# EasyEDA Pro project 通信+控制电路板.epro, board PCB1
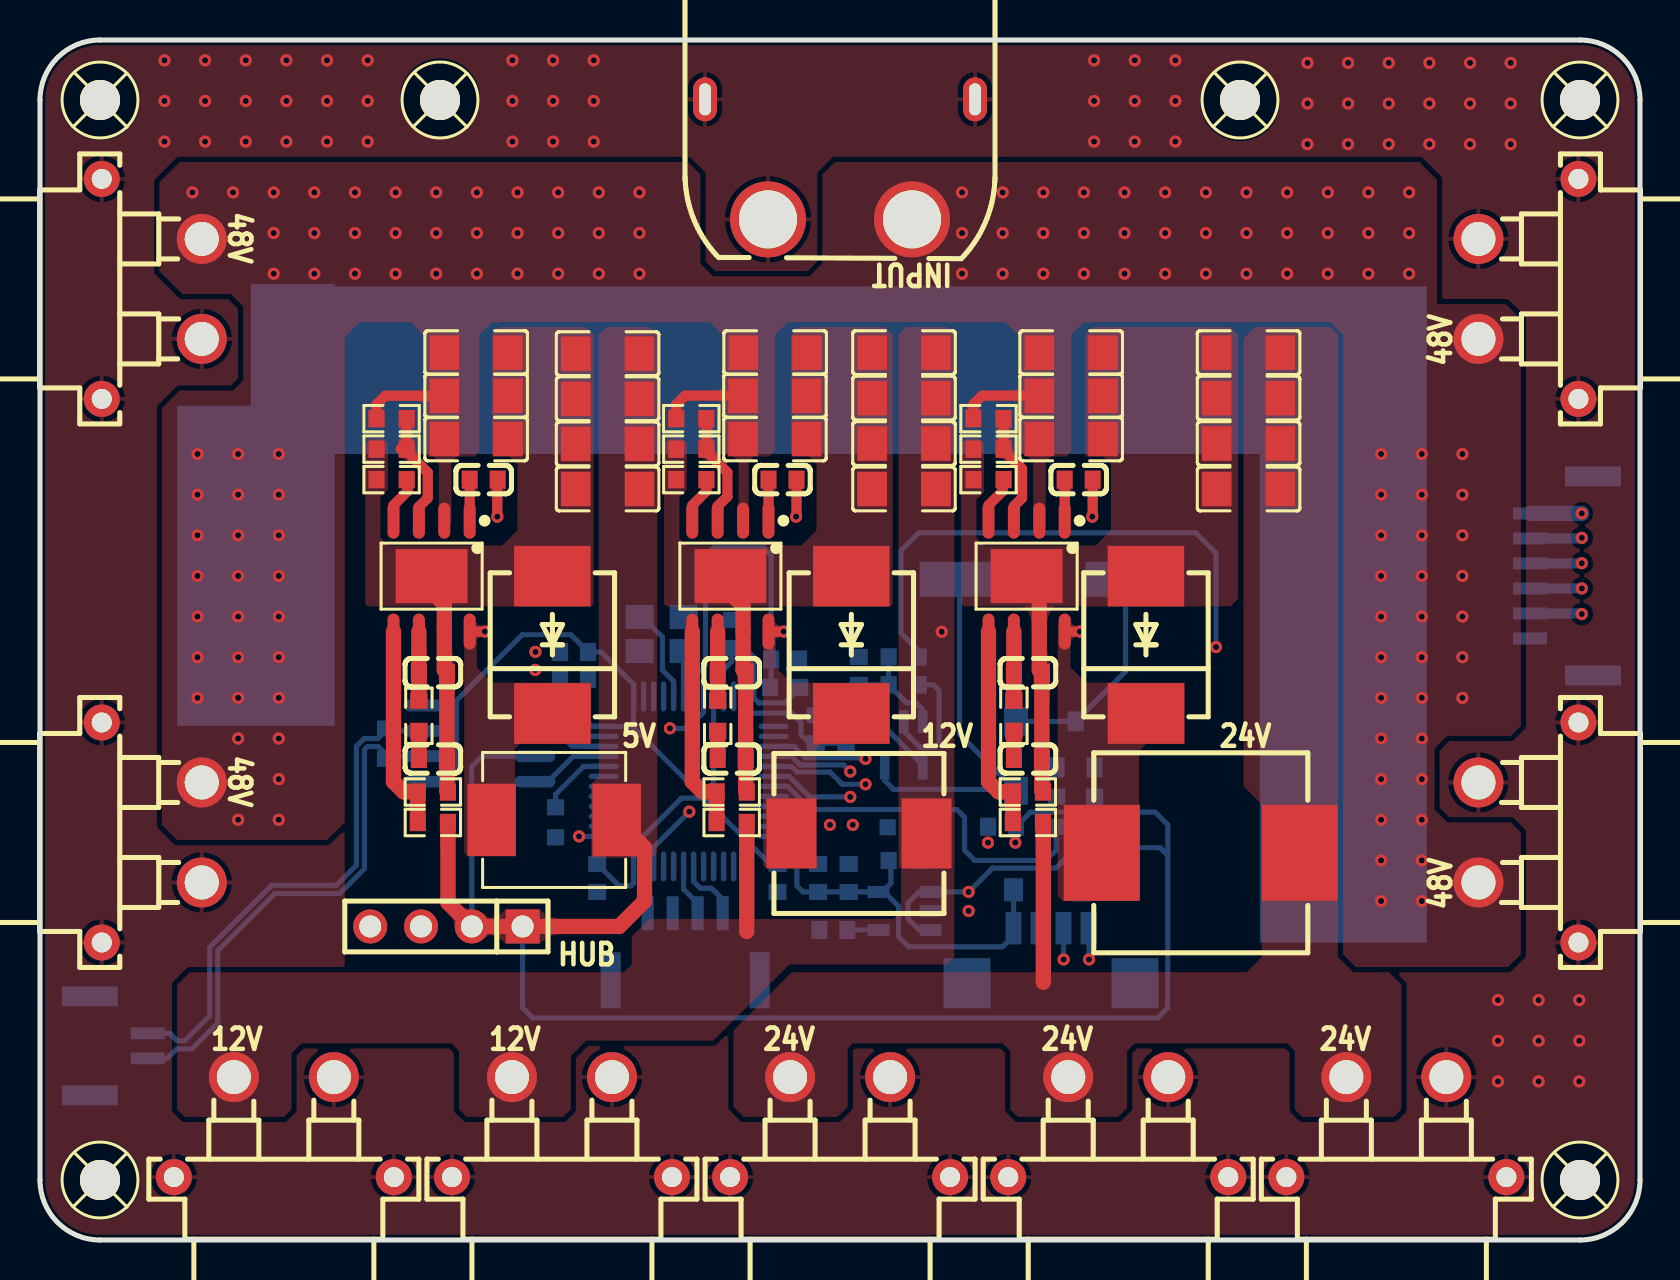
[diagram p2: board, top side]
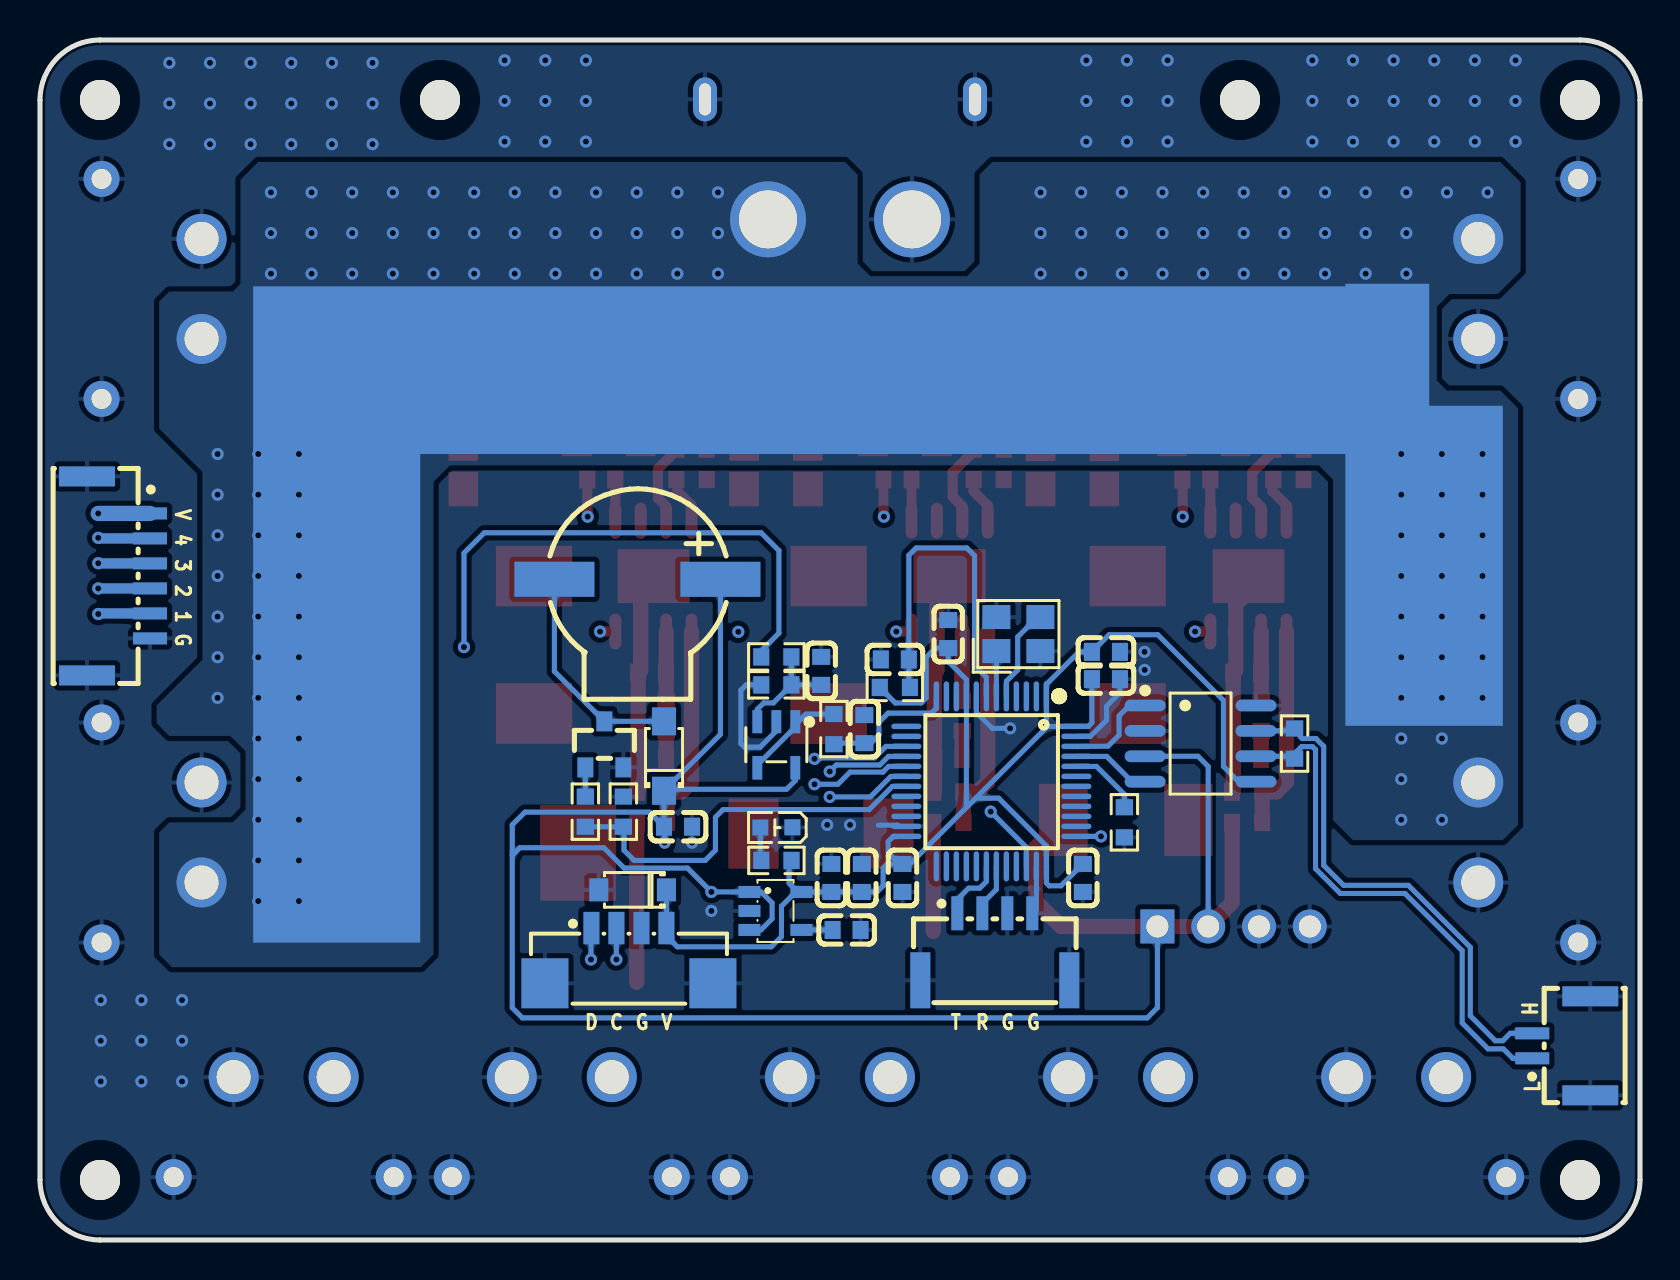
[diagram p3: board, bottom side, seen from below]

Outline 80 x 60 mm; copper layers: Top Layer, Inner1, Inner2, Bottom Layer. Coordinates in mm from the lower left corner of the outline.
Outline path: 0,57 0,3 arc(0.88,0.88) 3,0 77,0 arc(79.12,0.88) 80,3 80,57 arc(79.12,59.12) 77,60 3,60 arc(0.88,59.12) 0,57
Stack: Top Layer 0.035mm 外层铜厚1oz / Dielectric1 0.2104mm 7628 RC49% 8.6mil / Inner1 0.0152mm 内层铜厚 / Dielectric2 1.065mm 1.1mm H/HOZ Copper / Inner2 0.0152mm 内层铜厚 / Dielectric3 0.2104mm 7628 RC49% 8.6mil / Bottom Layer 0.035mm 外层铜厚1oz

## Design rules (mm)
net $1N17651: DP1
net $1N17659: DP1
template: JLCPCB Capability(Two Layers Board)
spacing copperThickness1oz (default): track to track 0.102, other pairs 0.152 to 0.3
spacing copperThickness2oz: track to track 0.203, other pairs 0.152 to 0.3
track width copperThickness1oz (default): min 0.127, default 0.254, max 2.54
track width copperThickness2oz: min 0.203, default 0.254, max 2.54
differential pair differentialPair (default): width min 0.127, default 0.254, max 2.54; gap min 0.152, default 0.152
via viaSize (default): diameter min 0.5, default 0.61, max 10; hole min 0.3, default 0.305, max 6.3

## Placement (name value [footprint] x y rotation side)
BUZZER1  MLT-9032  [BUZ-SMD_MLT-9032]  50.13 33.04 180 bottom
C1  2.2uF  [C1206]  51.56 44.37 180 top
C2  2.2uF  [C1206]  51.56 42.21 180 top
C3  2.2uF  [C1206]  51.56 40.05 180 top
C4  100nF  [C0603]  51.94 38.02 0 top
C6  2.2uF  [C1206]  36.76 44.37 180 top
C7  2.2uF  [C1206]  21.81 40.05 180 top
C8  22nF  [C0603]  49.4 24.05 180 top
C9  47pF  [C0603]  49.4 28.37 180 top
C10  2.2uF  [C1206]  36.75 42.21 180 top
C11  2.2uF  [C1206]  36.75 40.05 180 top
C13  100nF  [C0603]  37.12 38.02 0 top
C17  15nF  [C0603]  34.58 24.05 180 top
C18  47pF  [C0603]  34.58 28.37 180 top
C19  2.2uF  [C1206]  21.81 42.21 180 top
C20  2.2uF  [C1206]  21.81 44.37 180 top
C21  47uF  [C1206]  60.43 44.37 0 top
C22  100nF  [C0603]  22.18 38.02 0 top
C26  4.7nF  [C0603]  19.64 24.05 180 top
C27  47pF  [C0603]  19.64 28.37 180 top
C31  100nF  [C0603]  40.94 28.46 270 bottom
C32  100nF  [C0603]  38.78 25.54 270 bottom
C33  100nF  [C0603]  27.86 18.1 90 bottom
C34  100nF  [C0603]  36.88 18.1 90 bottom
C35  100nF  [C0603]  26.7 28.04 0 bottom
C36  100nF  [C0603]  34.59 30.3 270 bottom
C37  100nF  [C0603]  26.7 29.41 0 bottom
C38  100nF  [C0603]  37.26 29.03 180 bottom
C39  100nF  [C0603]  40.43 18.1 90 bottom
C40  10uF  [C0603]  38.91 18.1 90 bottom
C41  10nF  [C0603]  39.67 15.5 180 bottom
C51  47uF  [C1206]  60.43 42.1 0 top
C52  47uF  [C1206]  60.43 39.82 0 top
C53  47uF  [C1206]  60.43 37.55 0 top
C54  47uF  [C1206]  43.2 37.55 0 top
C55  47uF  [C1206]  43.2 39.82 0 top
C56  47uF  [C1206]  43.2 42.1 0 top
C57  47uF  [C1206]  43.2 44.37 0 top
C58  47uF  [C1206]  28.38 37.55 0 top
C59  47uF  [C1206]  28.38 39.81 0 top
C60  47uF  [C1206]  28.38 42.06 0 top
C61  47uF  [C1206]  28.38 44.32 0 top
C100  10uF  [C0603]  48.1 20.66 0 bottom
CN1  XT60PW-M  [CONN-TH_XT60PW-M]  40 54.03 270 top
CN2  HC-1.25-4PLT  [CONN-SMD_4P-P1.25_HCTL_HC-1.25-4PLT]  50.55 14.22 180 bottom
CN5  WAFER-GH1.25-2PWB  [CONN-TH_2P-P1.25_XUNPU_WAFER-GH1.25-2PWB]  3.94 9.71 90 bottom
D1  B560C-13-F  [SMC_L7.1-W6.2-LS8.1-RD]  55.3 29.76 90 top
D2  B560C-13-F  [SMC_L7.1-W6.2-LS8.1-RD]  40.57 29.76 90 top
D3  B560C-13-F  [SMC_L7.1-W6.2-LS8.1-RD]  25.62 29.76 90 top
D23  SMF3.3A  [SOD-123_L2.8-W1.8-LS3.7-RD]  50.37 17.51 0 bottom
D30  DSS34  [SOD-123FL_L2.7-W1.8-LS3.8-RD]  48.8 24.2 90 bottom
H1  PZ254V-11-04P  [HDR-TH_4P-P2.54-V-M]  20.32 15.68 180 top
L1  22uH  [IND-SMD_L10.7-W10.0_ETQP5MXXXX]  58.04 19.36 0 top
L2  22uH  [IND-SMD_L8.5-W8.0_XR0850]  40.95 20.33 0 top
L3  8.2uH  [IND-SMD_L7.0-W6.6_FXL0630]  25.71 21 180 top
LED1  NCD0603G1  [LED0603-RD_1]  43.18 20.63 0 bottom
NOREF  -  [Pad_e26283]  38.1 43.49 0 top
Q1  AO3400A  [SOT-23_L2.9-W1.3-P1.90-LS2.4-BR]  51.78 24.78 270 bottom
R1  442kΩ  [R0603]  47.43 41.07 180 top
R2  90.9kΩ  [R0603]  47.43 39.54 0 top
R3  243kΩ  [R0603]  47.43 38.02 0 top
R6  16.9kΩ  [R0603]  48.69 26.21 90 top
R7  442kΩ  [R0603]  32.57 41.07 180 top
R8  90.9kΩ  [R0603]  32.57 39.54 0 top
R9  243kΩ  [R0603]  32.57 38.02 0 top
R10  29.4kΩ  [R0603]  34.58 20.88 0 top
R11  2.1kΩ  [R0603]  34.58 22.4 180 top
R12  16.9kΩ  [R0603]  33.88 26.21 90 top
R13  442kΩ  [R0603]  17.58 41.07 180 top
R14  90.9kΩ  [R0603]  17.58 39.54 0 top
R15  243kΩ  [R0603]  17.58 38.02 0 top
R18  16.9kΩ  [R0603]  18.94 26.21 90 top
R19  51kΩ  [R0603]  19.64 20.88 0 top
R20  10kΩ  [R0603]  19.64 22.4 180 top
R21  100kΩ  [R0603]  49.4 20.88 0 top
R22  3.6kΩ  [R0603]  49.4 22.4 180 top
R23  10kΩ  [R0603]  43.18 27.76 180 bottom
R24  150kΩ  [R0603]  43.18 29.15 180 bottom
R25  33Ω  [R0603]  40.31 25.54 270 bottom
R51  1kΩ  [R0603]  37.26 27.63 0 bottom
R53  1kΩ  [R0603]  25.78 20.88 90 bottom
R54  1kΩ  [R0603]  43.18 18.98 180 bottom
R69  120Ω  [R0603]  17.27 24.82 90 bottom
R76  33Ω  [R0603]  52.73 21.42 90 bottom
R77  10kΩ  [R0603]  50.83 21.42 90 bottom
SCREW1  -  [M2螺丝]  3 57 0 top
SCREW2  -  [M2螺丝]  77 57 0 top
SCREW3  -  [M2螺丝]  3 3 0 top
SCREW4  -  [M2螺丝]  77 3 0 top
SCREW5  -  [M2螺丝]  20 57 0 top
SCREW7  -  [M2螺丝]  60 57 0 top
U1  TPS54560DDAR  [SOP-8_L4.9-W3.9-P1.27-LS6.0-BL-EP-3]  49.33 33.19 180 top
U2  TPS54560DDAR  [SOP-8_L4.9-W3.9-P1.27-LS6.0-BL-EP-3]  34.52 33.19 180 top
U3  TPS54560DDAR  [SOP-8_L4.9-W3.9-P1.27-LS6.0-BL-EP-3]  19.58 33.19 180 top
U4  XT30PW-F20.G.Y  [CONN-TH_XT30PW-F-1]  74.42 47.55 90 top
U5  XT30PW-F20.G.Y  [CONN-TH_XT30PW-F-1]  74.42 20.38 90 top
U6  XT30PW-F20.G.Y  [CONN-TH_XT30PW-F-1]  5.59 47.55 270 top
U7  XT30PW-F20.G.Y  [CONN-TH_XT30PW-F-1]  5.59 20.38 270 top
U8  XT30PW-F20.G.Y  [CONN-TH_XT30PW-F-1]  67.82 5.64 0 top
U9  XT30PW-F20.G.Y  [CONN-TH_XT30PW-F-1]  40 5.64 0 top
U10  XT30PW-F20.G.Y  [CONN-TH_XT30PW-F-1]  53.91 5.64 0 top
U11  XT30PW-F20.G.Y  [CONN-TH_XT30PW-F-1]  26.1 5.64 0 top
U12  XT30PW-F20.G.Y  [CONN-TH_XT30PW-F-1]  12.19 5.64 0 top
U13  GS8331-TR  [SOT-23-5_L3.0-W1.7-P0.95-LS2.8-BL]  43.18 24.76 0 bottom
U14  STM32F103C8T6  [LQFP-48_L7.0-W7.0-P0.50-LS9.0-BL]  32.43 22.93 0 bottom
U15  LP2992AIM5X-3.3/NOPB  [SOT-23-5_L3.0-W1.7-P0.95-LS2.8-BR]  43.23 16.45 0 bottom
U16  WAFER-GH1.25-4PLB  [CONN-SMD_4P-P1.25_XUNPU_WAFER-GH1.25-4PLB]  32.26 14.66 180 bottom
U20  SIT1042AQT/3  [SOIC-8_L4.9-W3.9-P1.27-LS6.0-BL]  21.97 24.82 270 bottom
U21  WAFER-GH1.25-6PWB  [CONN-SMD_6P-P1.25_XUNPU_WAFER-GH1.25-6PWB]  76.07 33.2 270 bottom
X1  8MHz  [CRYSTAL-SMD_4P-L3.2-W2.5-BL]  31.08 30.3 180 bottom

## Footprints (pads in the part's own frame, mm; a bottom-side part is the same pattern mirrored in y, then rotated)
BUZ-SMD_MLT-9032
  rect 4x1.75 smd: 1(4.15,0) 2(-4.15,0)
C0603
  rect 0.8x0.9 smd: 1(-0.7,0) 2(0.7,0)
C1206
  rect 1.485x1.728 smd: 1(-1.593,0) 2(1.593,0)
CONN-SMD_4P-P1.25_HCTL_HC-1.25-4PLT
  rect 0.8x1.62 smd: 1(-1.875,1.38) 2(-0.625,1.38) 3(0.625,1.38) 4(1.875,1.38)
  rect 2.35x2.5 smd: 5(-4.2,-1.38) 6(4.2,-1.38)
CONN-SMD_4P-P1.25_XUNPU_WAFER-GH1.25-4PLB
  rect 0.6x1.7 smd: 1(-1.875,1.675) 2(-0.625,1.675) 3(0.625,1.675) 4(1.875,1.675)
  rect 1x2.8 smd: 5(-3.725,-1.675) 6(3.725,-1.675)
CONN-SMD_6P-P1.25_XUNPU_WAFER-GH1.25-6PWB
  rect 0.6x1.7 smd: 1(-3.125,1.575) 2(-1.875,1.575) 3(-0.625,1.575) 4(0.625,1.575) 5(1.875,1.575) 6(3.125,1.575)
  rect 1x2.8 smd: 7(4.975,-1.575) 8(-4.975,-1.575)
CONN-TH_2P-P1.25_XUNPU_WAFER-GH1.25-2PWB
  rect 0.6x1.7 smd: 1(-0.625,1.45) 2(0.625,1.45)
  rect 1x2.8 smd: 3(-2.475,-1.45) 4(2.475,-1.45)
CONN-TH_XT30PW-F-1
  round 2.5 hole 1.7: 1(-2.5,2.5) 2(2.5,2.5)
  round 1.8 hole 1: 3(5.5,-2.5) 4(-5.5,-2.5)
CONN-TH_XT60PW-M
  round 3.8 hole 2.9: 1(3,-3.6) 2(3,3.6)
  oval 2.2x1.2 hole 1.6x0.6: 3(-3,6.75) 4(-3,-6.75)
CRYSTAL-SMD_4P-L3.2-W2.5-BL
  rect 1.4x1.2 smd: 1(-1.1,-0.85) 2(1.1,-0.85) 3(1.1,0.85) 4(-1.1,0.85)
HDR-TH_4P-P2.54-V-M
  rect 1.7x1.7 hole 1.1: 1(-3.81,0)
  round 1.7 hole 1.1: 2(-1.27,0) 3(1.27,0) 4(3.81,0)
IND-SMD_L7.0-W6.6_FXL0630
  rect 2.424x3.62 smd: 1(3.128,0) 2(-3.128,0)
IND-SMD_L8.5-W8.0_XR0850
  rect 2.5x3.5 smd: 1(-3.375,0) 2(3.375,0)
IND-SMD_L10.7-W10.0_ETQP5MXXXX
  rect 3.8x4.8 smd: 1(-4.95,0) 2(4.95,0)
LED0603-RD_1
  rect 0.8x0.8 smd: 1(-0.799,-0.004) 2(0.799,0.004)
LQFP-48_L7.0-W7.0-P0.50-LS9.0-BL
  oval 0.27x1.5 smd: 1(-2.75,-4.25) 2(-2.25,-4.25) 3(-1.75,-4.25) 4(-1.25,-4.25) 5(-0.75,-4.25) 6(-0.25,-4.25) 7(0.25,-4.25) 8(0.75,-4.25) 9(1.25,-4.25) 10(1.75,-4.25) 11(2.25,-4.25) 12(2.75,-4.25) 25(2.75,4.25) 26(2.25,4.25) 27(1.75,4.25) 28(1.25,4.25) 29(0.75,4.25) 30(0.25,4.25) 31(-0.25,4.25) 32(-0.75,4.25) 33(-1.25,4.25) 34(-1.75,4.25) 35(-2.25,4.25) 36(-2.75,4.25)
  oval 1.5x0.27 smd: 13(4.25,-2.75) 14(4.25,-2.25) 15(4.25,-1.75) 16(4.25,-1.25) 17(4.25,-0.75) 18(4.25,-0.25) 19(4.25,0.25) 20(4.25,0.75) 21(4.25,1.25) 22(4.25,1.75) 23(4.25,2.25) 24(4.25,2.75) 37(-4.25,2.75) 38(-4.25,2.25) 39(-4.25,1.75) 40(-4.25,1.25) 41(-4.25,0.75) 42(-4.25,0.25) 43(-4.25,-0.25) 44(-4.25,-0.75) 45(-4.25,-1.25) 46(-4.25,-1.75) 47(-4.25,-2.25) 48(-4.25,-2.75)
M2螺丝
  round 2 hole 2: 1(0,0)
Pad_e26283
  custom 62.484x32.94 smd far side: 49(0,0)
R0603
  rect 0.806x0.864 smd: 1(-0.753,0) 2(0.753,0)
SMC_L7.1-W6.2-LS8.1-RD
  rect 3.03x3.82 smd: 1(-3.435,0) 2(3.435,0)
SOD-123_L2.8-W1.8-LS3.7-RD
  rect 0.95x1.15 smd: 1(-1.692,0) 2(1.692,0)
SOD-123FL_L2.7-W1.8-LS3.8-RD
  rect 1.4x1.2 smd: 1(-1.735,0) 2(1.735,0)
SOIC-8_L4.9-W3.9-P1.27-LS6.0-BL
  oval 0.588x2.045 smd: 1(-1.905,-2.772) 2(-0.635,-2.772) 3(0.635,-2.772) 4(1.905,-2.772) 5(1.905,2.772) 6(0.635,2.772) 7(-0.635,2.772) 8(-1.905,2.772)
SOP-8_L4.9-W3.9-P1.27-LS6.0-BL-EP-3
  oval 0.6x1.8 smd: 1(-1.905,-2.772) 2(-0.635,-2.772) 3(0.635,-2.772) 4(1.905,-2.772) 5(1.905,2.772) 6(0.635,2.772) 7(-0.635,2.772) 8(-1.905,2.772)
  rect 3.6x2.7 smd: 9(0,0)
SOT-23-5_L3.0-W1.7-P0.95-LS2.8-BL
  rect 0.49x1.157 smd: 1(-0.95,-1.153) 2(0,-1.153) 3(0.95,-1.153)
  rect 0.49x1.175 smd: 4(0.95,1.153) 5(-0.95,1.153)
SOT-23-5_L3.0-W1.7-P0.95-LS2.8-BR
  rect 1.1x0.6 smd: 1(1.3,-0.95) 2(1.3,0) 3(1.3,0.95) 4(-1.3,0.95) 5(-1.3,-0.95)
SOT-23_L2.9-W1.3-P1.90-LS2.4-BR
  rect 1x0.8 smd: 1(1.15,-0.95) 2(1.15,0.95) 3(-1.15,0)

## Nets
As in the schematic, except:
48V: C1.2 C2.2 C3.2 C6.2 C7.2 C10.2 C11.2 C19.2 C20.2 CN1.2 NOREF.49 R1.2 R7.2 R13.2 R24.1 U1.2 U2.2 U3.2 U4.1 U5.1 U6.1 U7.1

Pads without a net: SCREW1 1; SCREW2 1; SCREW3 1; SCREW4 1; SCREW5 1; SCREW7 1; U14 2 3 4 10 11 13 14 20 21 22 25 26 27 28 29 32 33 38 39 40 41 42 43

## Via types
v1: diameter 0.61, hole 0.305, Top Layer to Bottom Layer, 218 vias

## Routing (per net, layer and track width the routed paths; a pad name or vN(x,y) marks a point on that pad's centre or on a via; arc(x,y) is an arc through that point)
3V3: length 77.9
  Bottom Layer w0.254: U14.24 37.34,20.18 37.59,19.93 37.59,19.36 37.04,18.8 ; 37.04,18.8 37.64,18.8 37.85,18.6 37.85,17.71 38.15,17.4 U15.5 ; 37.04,18.8 C34.2 36.5,18.8 33.68,21.62 ; 33.21,22.09 32.07,22.09 29.68,19.7 U14.36 29.68,17.85 29.54,17.71 28.95,17.71 C33.2 ; 33.21,22.09 29.65,25.65 ; 33.21,22.09 33.68,21.62 ; C35.2 27.4,25.87 27.59,25.68 U14.48 29.62,25.68 29.65,25.65 ; 29.65,25.65 29.68,25.67 U14.1 29.68,27.78 28.05,29.41 C37.2 26.55,30.26 24.11,30.26 20.83,26.98 20.83,23.68 20.19,23.04 19.33,23.04 U20.5 ; 33.68,21.62 U14.9 33.68,28.02 34.59,28.93 C36.2 35.23,29.6 35.69,29.14 35.69,27.11 35.94,26.85 37.23,26.85 R51.2 ; R54.2 42.54,18.86 42.54,17.84 42.11,17.4 42.22,17.4 42.93,16.69 42.93,15.17 43.43,14.66 48.13,14.66 48.68,15.21 CN2.4 48.68,17.63
5V: length 123.3
  Top Layer w0.762: R19.2 20.4,16.87 H1.2 H1.1 28.96,15.68 30.23,16.95 30.23,19.61 L3.2
  Bottom Layer w0.254: H1.2 21.59,23.68 22.1,24.19 U20.3 ; 23.75,15.93 24.13,15.55 24.13,11.61 24.64,11.1 55.88,11.1 56.39,11.61 56.39,19.23 ; C100.2 D30.1 ; C100.2 48.77,20.63 v1(48.77,19.87) ; C100.2 49.53,21.39 55.75,21.39 56.39,20.76 56.39,19.23 ; 56.39,19.23 56.01,19.61 51.81,19.61 50.8,18.6 47.63,18.6 v1(46.43,17.4) U15.1 43.94,17.4 43.4,16.86 43.4,16.06 43.95,15.5 U15.3 ; BUZZER1.1 45.98,25.28 48.73,22.53 42.67,22.53 42.23,22.97 42.23,23.61
12V: length 73.7
  Top Layer w0.762: R10.2 35.34,15.42
  Inner1 w0.762: v1(77.09,36.33) 77.22,36.2 77.41,36.2 78.17,36.96 78.17,38.04 77.54,38.66 75.76,38.66 75.12,38.03 75.12,16.25 72.83,13.96 61.53,13.96 v1(45.09,30.41)
  Bottom Layer w0.762: U21.1 v1(77.09,36.33)
24V: length 8
  Top Layer w0.762: 50.16,12.88 50.16,20.86 R21.2
48V: length 42.4
  Top Layer w0.508: C19.2 17.26,42.21 16.83,41.77 R13.2 ; C2.2 49.96,42.22 47.11,42.22 46.67,41.79 R1.2 ; C10.2 35.15,42.22 32.26,42.22 31.81,41.77 R7.2
  Inner2 w0.254: 61.34,29.01 59.44,29.01 v1(58.8,29.65)
  Bottom Layer w0.254: R24.1 43.94,29.46 43.05,30.34 43.05,34.47 43.94,35.36 57.78,35.36 58.8,34.35 v1(58.8,29.65)
  vias: v1(7.62,52.38) v1(7.87,39.3) v1(7.87,37.27) v1(7.87,35.23) v1(7.87,33.2) v1(7.87,31.17) v1(7.87,29.14) v1(7.87,27.11) v1(9.65,52.38) v1(9.91,39.3) v1(9.91,37.27) v1(9.91,35.23) v1(9.91,33.2) v1(9.91,31.17) v1(9.91,29.14) v1(9.91,27.11) v1(9.91,25.08) v1(9.91,21.01) v1(11.68,52.38) v1(11.68,50.35) v1(11.68,48.32) v1(11.94,39.3) v1(11.94,37.27) v1(11.94,35.23) v1(11.94,33.2) v1(11.94,31.17) v1(11.94,29.14) v1(11.94,27.11) v1(11.94,25.08) v1(11.94,23.04) v1(11.94,21.01) v1(13.72,52.38) v1(13.72,50.35) v1(13.72,48.32) v1(15.75,52.38) v1(15.75,50.35) v1(15.75,48.32) v1(17.78,52.38) v1(17.78,50.35) v1(17.78,48.32) v1(19.81,52.38) v1(19.81,50.35) v1(19.81,48.32) v1(21.84,52.38) v1(21.84,50.35) v1(21.84,48.32) v1(23.88,52.38) v1(23.88,50.35) v1(23.88,48.32) v1(25.91,52.38) v1(25.91,50.35) v1(25.91,48.32) v1(27.94,52.38) v1(27.94,50.35) v1(27.94,48.32) v1(29.97,52.38) v1(29.97,50.35) v1(29.97,48.32) v1(46.1,52.38) v1(46.1,50.35) v1(46.1,48.32) v1(48.13,52.38) v1(48.13,50.35) v1(48.13,48.32) v1(50.16,52.38) v1(50.16,50.35) v1(50.16,48.32) v1(52.2,52.38) v1(52.2,50.35) v1(52.2,48.32) v1(54.23,52.38) v1(54.23,50.35) v1(54.23,48.32) v1(56.26,52.38) v1(56.26,50.35) v1(56.26,48.32) v1(58.29,52.38) v1(58.29,50.35) v1(58.29,48.32) v1(60.32,52.38) v1(60.32,50.35) v1(60.32,48.32) v1(62.36,52.38) v1(62.36,50.35) v1(62.36,48.32) v1(64.39,52.38) v1(64.39,50.35) v1(64.39,48.32) v1(66.42,52.38) v1(66.42,50.35) v1(66.42,48.32) v1(67.06,39.3) v1(67.06,37.27) v1(67.06,35.23) v1(67.06,33.2) v1(67.06,31.17) v1(67.06,29.14) v1(67.06,27.11) v1(67.06,25.08) v1(67.06,23.04) v1(67.06,21.01) v1(67.06,18.98) v1(67.06,16.95) v1(68.45,52.38) v1(68.45,50.35) v1(68.45,48.32) v1(69.09,39.3) v1(69.09,37.27) v1(69.09,35.23) v1(69.09,33.2) v1(69.09,31.17) v1(69.09,29.14) v1(69.09,27.11) v1(69.09,25.08) v1(69.09,23.04) v1(69.09,21.01) v1(69.09,18.98) v1(69.09,16.95) v1(71.12,39.3) v1(71.12,37.27) v1(71.12,35.23) v1(71.12,33.2) v1(71.12,31.17) v1(71.12,29.14) v1(71.12,27.11)
GND: length 50
  Top Layer w0.762: 49.83,32.69 49.97,32.56 U1.7 49.97,28.5 C9.1 C8.1 50.09,22.45 R22.1 ; U3.9 19.58,32.42 20.21,31.78 U3.7 20.21,28.5 C27.1 C26.1 20.34,22.45 R20.1 ; U2.9 34.52,32.34 35.15,31.7 U2.7 35.15,28.5 C18.1 C17.1 35.28,22.45 R11.1
  Bottom Layer w0.254: v1(31.5,25.58) 32.38,25.58 33.18,26.38 U14.8 ; 38.09,20.74 37.12,20.74 37.06,20.68 U14.23 ; U14.47 27.48,25.18 26.67,25.99 26.67,26.69 26,27.36 C35.1 ; U16.4 30.18,16.54 U14.35 ; R23.1 44.69,27.76 44.96,27.49 44.96,24.82 44.78,24.64 43.99,24.64 43.18,25.45 U13.2
  vias: v1(6.22,58.98) v1(6.22,56.95) v1(6.22,54.92) v1(8.25,58.98) v1(8.25,56.95) v1(8.25,54.92) v1(10.29,58.98) v1(10.29,56.95) v1(10.29,54.92) v1(12.32,58.98) v1(12.32,56.95) v1(12.32,54.92) v1(14.35,58.98) v1(14.35,56.95) v1(14.35,54.92) v1(16.38,58.98) v1(16.38,56.95) v1(16.38,54.92) v1(23.62,58.98) v1(23.62,56.95) v1(23.62,54.92) v1(24.77,29.41) v1(24.76,28.5) v1(25.65,58.98) v1(25.65,56.95) v1(25.65,54.92) v1(27.69,58.98) v1(27.69,56.95) v1(27.69,54.92) v1(39.5,20.76) v1(40.64,20.76) v1(46.43,16.45) v1(47.4,19.87) v1(52.71,58.98) v1(52.71,56.95) v1(52.71,54.92) v1(54.74,58.98) v1(54.74,56.95) v1(54.74,54.92) v1(56.77,58.98) v1(56.77,56.95) v1(56.77,54.92) v1(63.37,58.86) v1(63.37,56.83) v1(63.37,54.79) v1(65.41,58.86) v1(65.41,56.83) v1(65.41,54.79) v1(67.44,58.86) v1(67.44,56.83) v1(67.44,54.79) v1(69.47,58.86) v1(69.47,56.83) v1(69.47,54.79) v1(71.5,58.86) v1(71.5,56.83) v1(71.5,54.79) v1(72.9,11.99) v1(72.9,9.96) v1(72.9,7.93) v1(73.53,58.86) v1(73.53,56.83) v1(73.53,54.79) v1(74.93,11.99) v1(74.93,9.96) v1(74.93,7.93) v1(76.96,11.99) v1(76.96,9.96) v1(76.96,7.93)
V48_ADC: length 6.8
  Bottom Layer w0.254: R25.2 40.25,24.84 C32.2 38.46,24.84 38.05,25.25 38.05,25.89 37.59,26.34 35.43,26.34 35.18,26.6 U14.12
BUZZER: length 19.9
  Bottom Layer w0.254: R77.1 R76.1 ; 50.8,20.63 50.8,19.49 50.29,18.98 46.74,18.98 46.23,19.49 46.23,21.14 45.85,21.52 38.54,21.52 37.38,22.68 U14.19
CAN_RX: length 4
  Bottom Layer w0.254: U20.4 25.4,22.92 26.66,24.18 U14.45
CAN_TX: length 4.8
  Bottom Layer w0.254: U20.1 25.53,26.73 26.04,26.21 26.04,25.24 26.6,24.69 28.17,24.67 28.18,24.68
LED1: length 66.4
  Inner1 w0.254: v1(41.28,24.06) 41.78,24.06 44.59,21.25 48.41,21.25 48.43,21.22 49.93,21.22 54.61,16.54 54.61,14.39 56.07,12.93 72.95,12.93 78.23,18.22 78.23,30.79 77.72,31.3 v1(77.09,31.3)
  Bottom Layer w0.254: v1(41.28,24.06) 41.02,24.06 40.97,24.11 38.27,24.11 37.7,24.68 U14.15
  Bottom Layer w0.508: U21.5 77.06,31.33 v1(77.09,31.3)
LED2: length 71.3
  Inner1 w0.254: v1(77.09,32.58) 77.1,32.57 77.85,32.57 78.59,31.83 78.59,13.11 78.06,12.58 55.92,12.58 54.25,14.25 54.25,16.4 49.89,20.76 44.58,20.76 41.91,23.42 v1(40.51,23.42)
  Bottom Layer w0.254: U14.16 37.57,24.18 38,23.75 40.19,23.75 v1(40.51,23.42)
  Bottom Layer w0.508: U21.4 v1(77.09,32.58)
LED3: length 74.3
  Inner1 w0.254: v1(77.09,33.84) 78.23,33.84 78.94,33.13 78.94,12.96 77.19,11.21 56.79,11.21 53.9,14.1 53.9,16.25 50.94,19.21 44.85,19.21 v1(41.28,22.79)
  Bottom Layer w0.254: v1(41.28,22.79) 40.11,22.79 39.5,23.4 37.86,23.4 37.57,23.68 U14.17
  Bottom Layer w0.508: U21.3 77.08,33.83 v1(77.09,33.84)
LED4: length 76.5
  Inner1 w0.254: v1(40.51,22.15) 43.81,18.85 50.79,18.85 53.54,16.1 53.54,13.95 56.64,10.85 77.34,10.85 79.3,12.81 79.3,34.42 78.61,35.11 v1(77.09,35.11)
  Bottom Layer w0.254: v1(40.51,22.15) 38.48,22.15 37.46,23.18 U14.18
  Bottom Layer w0.508: U21.2 77.06,35.08 v1(77.09,35.11)
NRST: length 17.5
  Bottom Layer w0.254: R51.1 36.56,27.68 36.56,34.24 36.19,34.6 33.66,34.6 33.27,34.22 33.27,28.73 32.68,28.13 U14.7
OSC_IN: length 4.8
  Bottom Layer w0.254: X1.3 30.12,31.15 31.12,30.16 31.12,28.5 31.68,27.94 U14.5
OSC_OUT: length 2.3
  Bottom Layer w0.254: X1.1 U14.6
SWCLK: length 31.6
  Inner1 w0.254: v1(51.18,14.03) 51.18,17.45 50.55,18.09 29.04,18.09 v1(26.95,20.18)
  Bottom Layer w0.254: U14.37 v1(26.95,20.18) ; v1(51.18,14.03) 51.18,15.59 CN2.2
SWDIO: length 29.7
  Inner1 w0.254: v1(32.46,21.42) 35.44,18.45 50.69,18.45 52.45,16.69 v1(52.45,14.03)
  Bottom Layer w0.254: CN2.1 52.45,15.57 v1(52.45,14.03) ; v1(32.46,21.42) 30.68,19.63 U14.34
UART1_RX: length 2.5
  Bottom Layer w0.254: 32.88,16.46 32.88,16.83 32.18,17.53 U14.31
UART1_TX: length 3.1
  Bottom Layer w0.254: 34.13,16.46 34.13,17.03 33.57,17.59 33.01,17.59 32.68,17.92 U14.30
$1N640: length 5.7
  Top Layer w0.508: U1.3 48.69,36.69 49.1,37.09 49.1,38.56 48.18,39.49 R2.2 R1.1
$1N771: length 2.3
  Top Layer w0.508: U1.4 47.43,36.73 48.13,37.44 48.13,38.02
$1N1086: length 2.1
  Top Layer w0.508: U1.1 C4.1
$1N1094: length 8.6
  Top Layer w0.508: C4.2 52.63,36.19 v1(52.62,36.17) ; U1.8 v1(52,30.42)
  Inner1 w0.508: v1(52.62,36.17) 52.62,31.04 v1(52,30.42)
$1N1713: length 1.4
  Top Layer w0.762: R6.1 C8.2
$1N1785: length 3.5
  Top Layer w0.762: R6.2 C9.2 U1.6
$1N2645: length 5.7
  Top Layer w0.508: U2.3 33.88,36.68 34.37,37.17 34.37,38.38 33.32,39.43 R8.2 R7.1
$1N2651: length 2.3
  Top Layer w0.508: R9.2 33.32,37.44 32.61,36.73 U2.4
$1N2674: length 2.1
  Top Layer w0.508: U2.1 C13.1
$1N2678: length 8.6
  Top Layer w0.508: U2.8 v1(37.19,30.42) ; C13.2 37.82,36.19 v1(37.8,36.17)
  Inner1 w0.508: v1(37.19,30.42) 37.8,31.04 v1(37.8,36.17)
$1N2694: length 10.5
  Top Layer w0.762: 33.83,20.88 33.83,22.4 33.82,22.41 33.12,22.41 32.61,22.92 U2.5
$1N2698: length 1.4
  Top Layer w0.762: R12.1 C17.2
$1N2700: length 3.5
  Top Layer w0.762: R12.2 C18.2 U2.6
$1N3482: length 5.7
  Top Layer w0.508: R13.1 18.33,39.85 18.03,39.55 ; 18.33,39.43 19.38,38.38 19.38,37.09 18.94,36.65 U3.3
$1N3488: length 2.3
  Top Layer w0.508: 18.38,38.02 18.38,37.44 17.67,36.73 U3.4
$1N3511: length 2.1
  Top Layer w0.508: U3.1 C22.1
$1N3515: length 8.6
  Top Layer w0.508: v1(22.86,36.17) 22.86,38 C22.2 ; U3.8 v1(22.25,30.42)
  Inner1 w0.508: v1(22.25,30.42) 22.86,31.04 v1(22.86,36.17)
$1N3535: length 1.4
  Top Layer w0.762: R18.1 C26.2
$1N3537: length 3.5
  Top Layer w0.762: U3.6 C27.2 R18.2
$1N4335: length 10.5
  Top Layer w0.762: R21.1 R22.2 48.63,22.41 47.93,22.41 47.43,22.92 U1.5
$1N4383: length 10.5
  Top Layer w0.762: R19.1 R20.2 18.88,22.41 18.18,22.41 17.67,22.92 U3.5
$1N6178: length 5.7
  Bottom Layer w0.254: U13.3 44.13,26.53 43.81,26.85 43.33,26.85 R23.2 ; R23.2 C31.2 ; R23.2 R24.2
$1N6526: length 5.1
  Bottom Layer w0.254: 44.13,23.61 44.13,23.75 42.23,25.65 ; 40.31,26.3 41.7,26.3 42.29,25.71
$1N8542: length 3.6
  Bottom Layer w0.254: R53.2 25.78,22.29 27.18,23.68 U14.44
$1N8650: length 1.7
  Bottom Layer w0.254: LED1.2 43.98,19.03 R54.1
$1N9418: length 1.6
  Bottom Layer w0.254: U15.4 C41.1
$1N16834: length 11.1
  Bottom Layer w0.254: BUZZER1.2 54.28,28.43 Q1.3 D30.2
$1N16836: length 1.5
  Bottom Layer w0.254: R76.2 Q1.1
$1N17651: length 25.5
  Bottom Layer w0.254: R69.2 17.1,25.57 16.99,25.46 ; 16.99,25.46 16.99,25.17 16.89,25.08 16.2,25.08 15.82,24.69 15.82,18.73 14.82,17.73 11.58,17.73 8.48,14.64 8.48,11.21 7.24,9.96 6.86,9.96 6.49,10.33 CN5.2 ; 16.99,25.46 18.31,25.46
$1N17659: length 25.5
  Bottom Layer w0.254: 18.31,24.19 17.15,24.19 ; 17.15,24.19 R69.1 ; 17.15,24.19 17.15,24.43 16.92,24.67 16.37,24.67 16.22,24.52 16.22,18.56 14.99,17.33 11.75,17.33 8.89,14.47 8.89,10.85 7.59,9.56 6.83,9.56 6.36,9.08 CN5.1

## Copper pours and planes (outline as drawn; the poured copper is in the pictures)
5V on Top Layer: 27.56,45.65 30.86,45.65 30.86,19.11 27.56,19.11
12V on Top Layer: 6.86,22.03 45.72,22.03 45.72,6.15 6.86,6.15
12V on Top Layer: 42.93,45.65 45.72,45.65 45.72,18.6 42.93,18.6
24V on Top Layer: 34.67,21.77 68.07,21.77 68.07,6.15 34.67,6.15
24V on Top Layer: 60.18,45.65 64.9,45.65 64.9,16.95 60.18,16.95
48V on Top Layer: 5.97,53.9 74.05,53.9 74.05,13.64 5.97,13.64
48V on Bottom Layer: 5.97,53.9 74.17,53.9 74.17,13.64 5.97,13.64
48V on Inner1: 5.97,53.9 74.05,53.9 74.05,14.66 5.97,14.66
48V on Inner2: 5.97,53.9 74.05,53.9 74.05,13.64 5.97,13.64
GND on Top Layer: -16,76.76 93.85,76.76 93.85,-16.07 -16,-16.07
GND on Top Layer: 16.26,45.65 27.69,45.65 27.69,31.68 16.26,31.68
GND on Top Layer: 31.2,45.65 42.63,45.65 42.63,31.68 31.2,31.68
GND on Top Layer: 46.06,45.65 59.9,45.65 59.9,31.68 46.06,31.68
GND on Bottom Layer: -24.77,65.46 107.95,65.46 107.95,-14.55 -24.77,-14.55
GND on Inner1: -11.94,69.4 88.01,69.4 88.01,-10.36 -11.94,-10.36
GND on Inner2: -25.27,72.45 95.12,72.45 95.12,-11.88 -25.27,-11.88
$1N1094 on Top Layer: 50.89,31.11 57.24,31.11 57.24,16.95 50.89,16.95
$1N2678 on Top Layer: 36.16,30.92 42.51,30.92 42.51,18.6 36.16,18.6
$1N3515 on Top Layer: 21.21,30.92 27.56,30.92 27.56,19.23 21.21,19.23

Small or netless copper shapes (teardrops, artwork), in the pictures only: 86 on Top Layer, 109 on Bottom Layer, 17 on Inner1, 1 on Inner2

## Text on the board
Bottom Silkscreen Layer: G | R | T | V | C | D | H | 4 | 3 | 2 | 1 | L
Top Silkscreen Layer: 12V | HUB | 5V | 24V | 48V | INPUT
